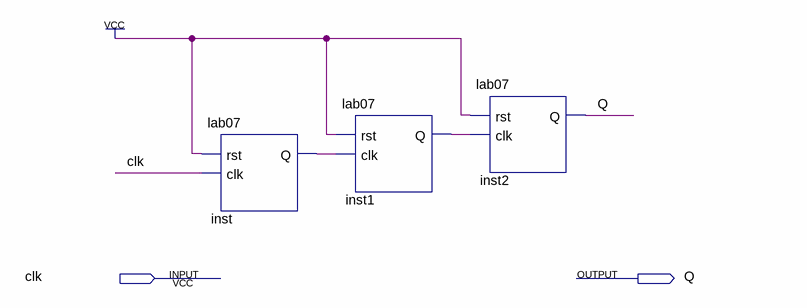
[diagram p0: schematic sheet]
// Quartus schematic lab071.bdf as structural Verilog: 3 symbols, 2 pins
module lab071 (
  input  clk,
  output Q
);

  wire inst1_q, inst_q;

  lab07 inst (.rst(1'b1), .clk(clk), .Q(inst_q));
  lab07 inst1 (.rst(1'b1), .clk(inst_q), .Q(inst1_q));
  lab07 inst2 (.rst(1'b1), .clk(inst1_q), .Q(Q));
endmodule
